# EAGLE design pits_hx1_v1.0 (EAGLE 6.4)
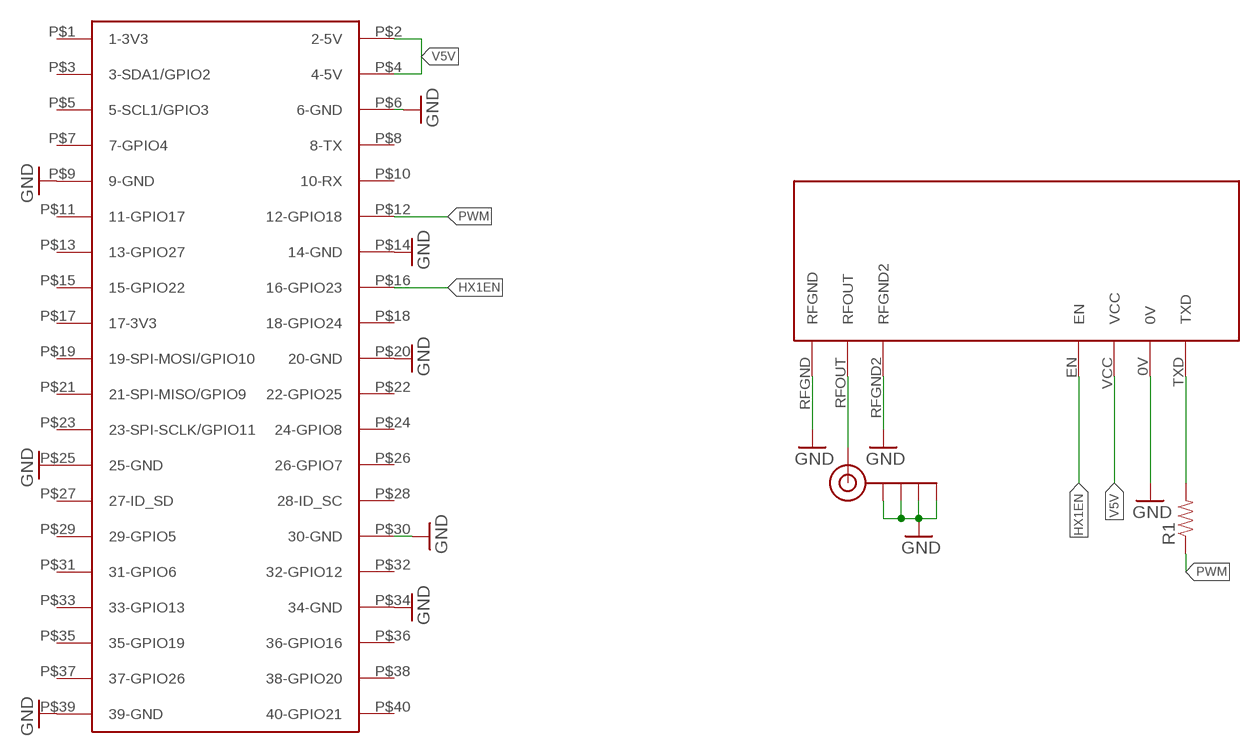
[diagram p0: schematic, sheet 1]

## Parts
J$1  SMA_EDGE  [SMA-EDGE]
R1  RESISTOR0603-RES  [0603-RES]
U$1  RASPBERRY-PI+  [RASPBERRY-PI-PLUS-CAM_NOTCH]
U$2  RADIOMETRIX-HX1  [RADIOMETRIX-HX1]

## Nets
GND: J$1.GND@0(GND) J$1.GND@1(GND) J$1.GND@2(GND) J$1.GND@3(GND) U$1.P$6(6-GND) U$1.P$9(9-GND) U$1.P$14(14-GND) U$1.P$20(20-GND) U$1.P$25(25-GND) U$1.P$30(30-GND) U$1.P$34(34-GND) U$1.P$39(39-GND) U$2.0V U$2.RFGND U$2.RFGND2
HX1EN: U$1.P$16(16-GPIO23) U$2.EN
N$4: R1.2 U$2.TXD
N$5: J$1.SIG(SIGNAL) U$2.RFOUT
PWM: R1.1 U$1.P$12(12-GPIO18)
V5V: U$1.P$2(2-5V) U$1.P$4(4-5V) U$2.VCC
Unconnected: U$1.P$1(1-3V3) U$1.P$3(3-SDA1/GPIO2) U$1.P$5(5-SCL1/GPIO3) U$1.P$7(7-GPIO4) U$1.P$8(8-TX) U$1.P$10(10-RX) U$1.P$11(11-GPIO17) U$1.P$13(13-GPIO27) U$1.P$15(15-GPIO22) U$1.P$17(17-3V3) U$1.P$18(18-GPIO24) U$1.P$19(19-SPI-MOSI/GPIO10) U$1.P$21(21-SPI-MISO/GPIO9) U$1.P$22(22-GPIO25) U$1.P$23(23-SPI-SCLK/GPIO11) U$1.P$24(24-GPIO8) U$1.P$26(26-GPIO7) U$1.P$27(27-ID_SD) U$1.P$28(28-ID_SC) U$1.P$29(29-GPIO5) U$1.P$31(31-GPIO6) U$1.P$32(32-GPIO12) U$1.P$33(33-GPIO13) U$1.P$35(35-GPIO19) U$1.P$36(36-GPIO16) U$1.P$37(37-GPIO26) U$1.P$38(38-GPIO20) U$1.P$40(40-GPIO21)

## Library data of the parts
J$1 = SparkFun:SMA_EDGE: SMA Antenna Connector End launch SMA connector. The paste layer has been removed so that the connector can be hand soldered onto the board after reflow.
R1 = SparkFun:RESISTOR: Resistor Basic schematic elements and footprints for 0603, 1206, and PTH resistors.
U$1 = Ava:RASPBERRY-PI+: Samtec SSW-120-01-T-D
U$2 = Ava:RADIOMETRIX-HX1

## Net classes
0 default: width 0.203 mm

## Board
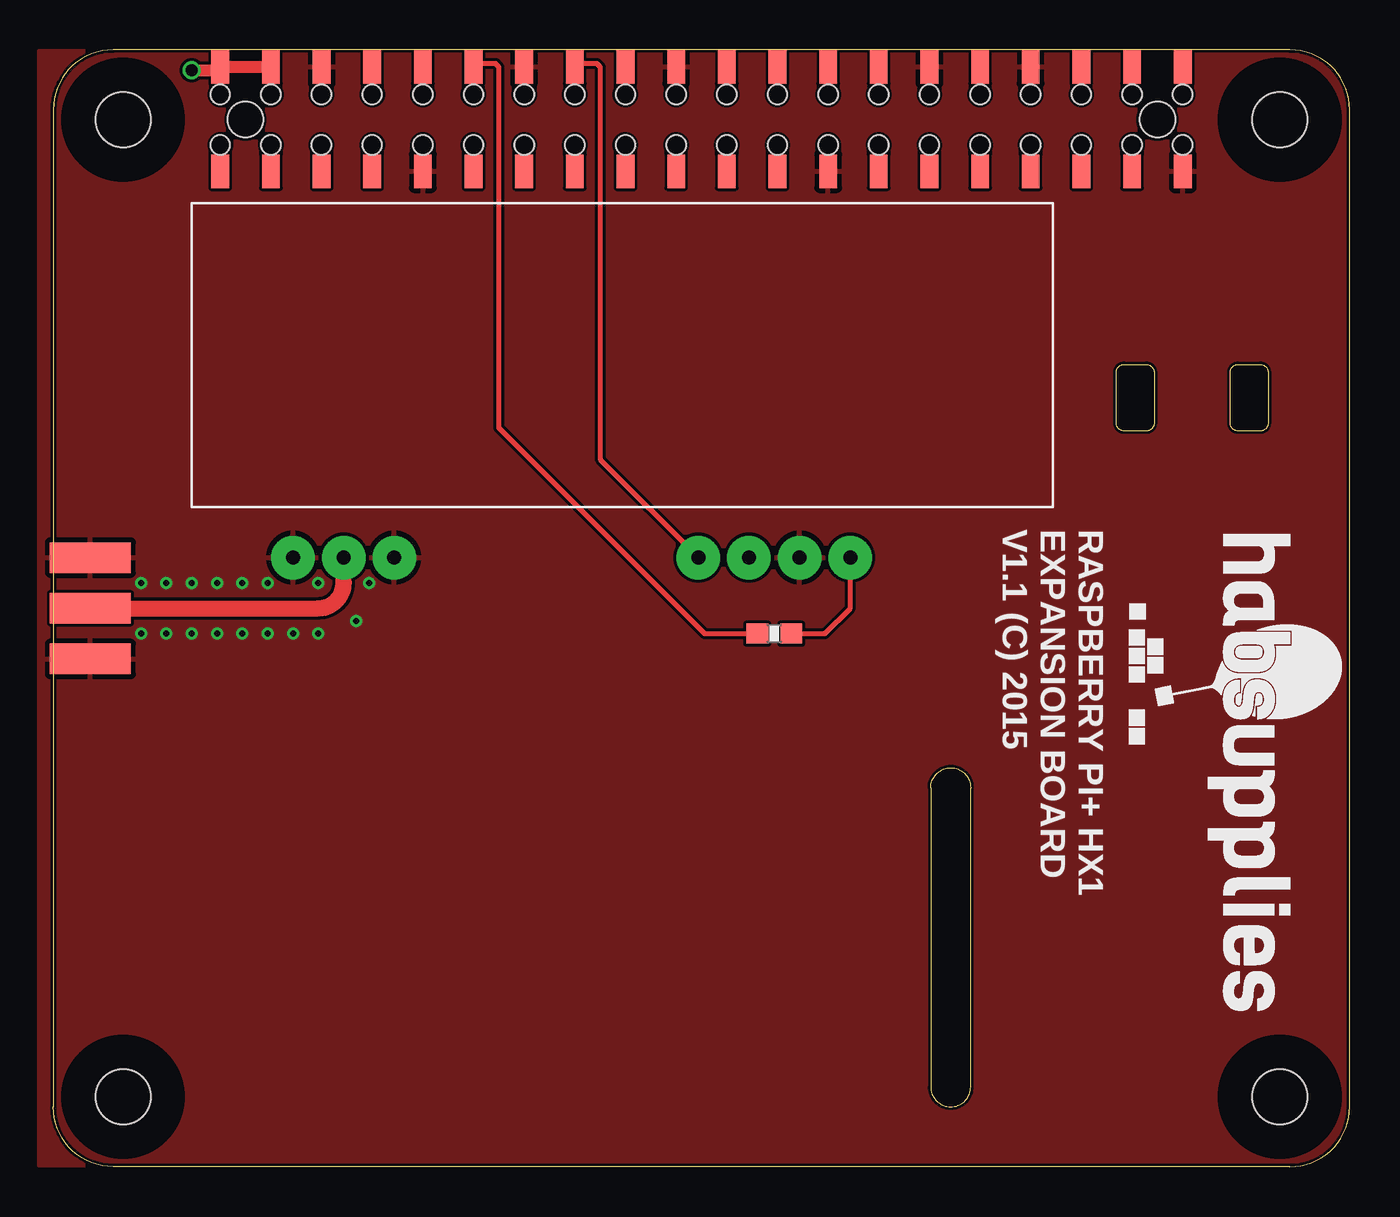
[diagram p1: board, top side]
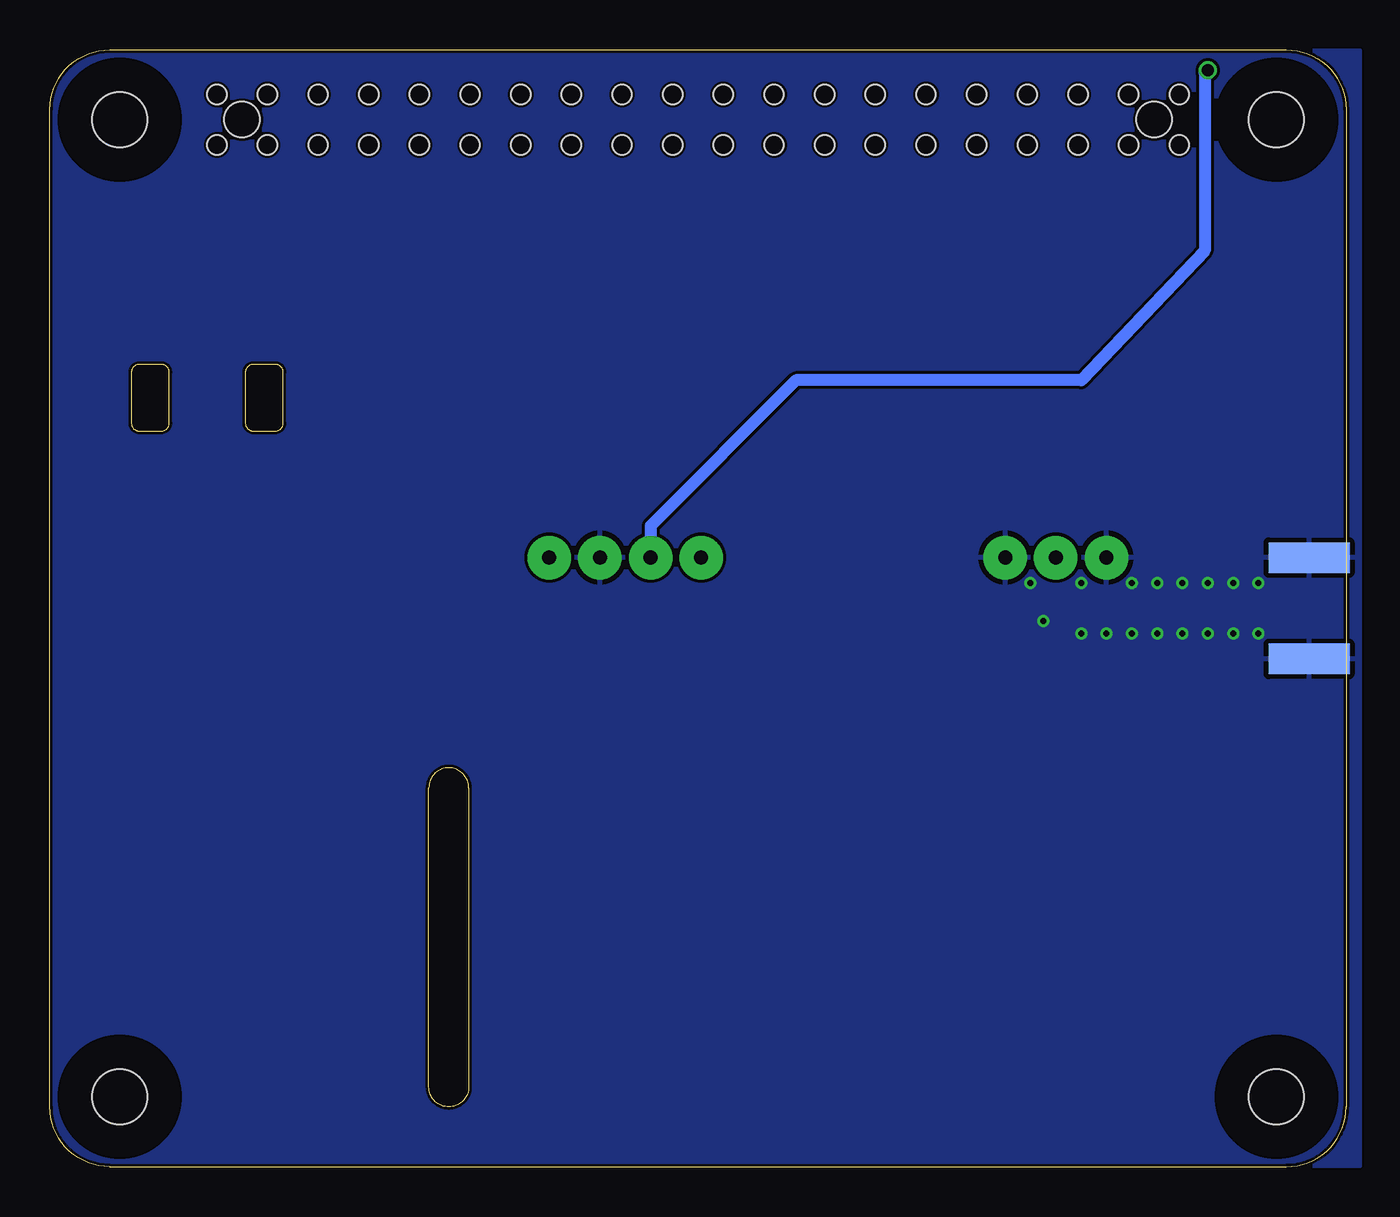
[diagram p2: board, bottom side, seen from below]

Size 65 x 56 mm. Coordinates in mm from the lower left corner, seen from the top.
Outline: 59.41,40.22 60.52,40.22 arc-90 60.91,39.82 60.91,37.29 arc-90 60.52,36.89 59.41,36.89 arc-90 59.01,37.29 59.01,39.82 arc-90 59.41,40.22
Outline: 53.7,40.22 54.8,40.22 arc-90 55.2,39.82 55.2,37.29 arc-90 54.8,36.89 53.7,36.89 arc-90 53.3,37.29 53.3,39.82 arc-90 53.7,40.22
Copper layers (1*16): Top 0.035mm / dielectric 1.5mm / Bottom 0.035mm
Design rules "Hackvana": minimum track width 0.15mm, minimum drill 0.3mm, track to track 6mil, track to pad 6mil, pad to pad 6mil, via to via 6mil, smd to smd 0mil, copper to edge 6mil, drill to drill 6mil, minimum pad ring 10mil, minimum via ring 6mil, stop-mask expansion 2mil, vias tented up to drill 100mil, thermal gap 10mil

### Footprints (pad centres in the part's own frame; a part is rotated, then mirrored left to right if it is on the bottom)
SMA-EDGE = smd 1.524 x 4.064: GND@0 -2.54,0; GND@1 2.54,0; SIG 0,0 | smd 1.524 x 4.064 bottom: GND@2 -2.54,0; GND@3 2.54,0
0603-RES = smd 1.1 x 1: 1 -0.85,0; 2 0.85,0
RASPBERRY-PI-PLUS-CAM_NOTCH = smd 0.889 x 1.68: P$1 -34.13,21.905; P$2 -34.13,27.145; P$3 -31.59,21.905; P$4 -31.59,27.145; P$5 -29.05,21.905; P$6 -29.05,27.145; P$7 -26.51,21.905; P$8 -26.51,27.145; P$9 -23.97,21.905; P$10 -23.97,27.145; P$11 -21.43,21.905; P$12 -21.43,27.145; P$13 -18.89,21.905; P$14 -18.89,27.145; P$15 -16.35,21.905; P$16 -16.35,27.145; P$17 -13.81,21.905; P$18 -13.81,27.145; P$19 -11.27,21.905; P$20 -11.27,27.145; P$21 -8.73,21.905; P$22 -8.73,27.145; P$23 -6.19,21.905; P$24 -6.19,27.145; P$25 -3.65,21.905; P$26 -3.65,27.145; P$27 -1.11,21.905; P$28 -1.11,27.145; P$29 1.43,21.905; P$30 1.43,27.145; P$31 3.97,21.905; P$32 3.97,27.145; P$33 6.51,21.905; P$34 6.51,27.145; P$35 9.05,21.905; P$36 9.05,27.145; P$37 11.59,21.905; P$38 11.59,27.145; P$39 14.13,21.905; P$40 14.13,27.145 | hole 2.75: -39,24.5; 19,24.5; -39,-24.5; 19,-24.5 | hole 1.78: -32.86,24.5; 12.86,24.5 | hole 0.97: -34.13,25.77; -31.59,25.77; -29.05,25.77; -26.51,25.77; -23.97,25.77; -21.43,25.77; -18.89,25.77; -16.35,25.77; -13.81,25.77; -11.27,25.77; -8.73,25.77; -6.19,25.77; -3.65,25.77; -1.11,25.77; 1.43,25.77; 3.97,25.77; 6.51,25.77; 9.05,25.77; 11.59,25.77; 14.13,25.77; -34.13,23.23; -31.59,23.23; -29.05,23.23; -26.51,23.23; -23.97,23.23; -21.43,23.23; -18.89,23.23; -16.35,23.23; -13.81,23.23; -11.27,23.23; -8.73,23.23; -6.19,23.23; -3.65,23.23; -1.11,23.23; 1.43,23.23; 3.97,23.23; 6.51,23.23; 9.05,23.23; 11.59,23.23; 14.13,23.23
RADIOMETRIX-HX1 = drill 0.7 pad 2.184: 0V 8.89,-10.16; EN 3.81,-10.16; RFGND -11.43,-10.16; RFGND2 -16.51,-10.16; RFOUT -13.97,-10.16; TXD 11.43,-10.16; VCC 6.35,-10.16

### Placement (x,y rotation side)
J$1  1.86,28 90 top
R1  36.15,26.73 0 top
U$1  42.5,28 0 top
U$2  28.53,40.7 0 top
U$3  [NEW-HS-LOGO-MED]  53.93,31.81 270 top

### Tracks (layer width: path | path; a pad name or v marks a point on that pad's centre or on a via)
GND  (via drill 0.3)
  other vias: 13.29,29.27 10.75,29.27 9.48,29.27 8.21,29.27 6.94,29.27 5.67,29.27 4.4,29.27 4.4,26.73 5.67,26.73 6.94,26.73 8.21,26.73 9.48,26.73 10.75,26.73 12.02,26.73 13.29,26.73 15.83,29.27 15.2,27.36
  pour Top: 0.59,55.94 65.36,55.94 65.36,0.06 -0.68,0.06 -0.68,55.94
  pour Bottom: 0.59,55.94 65.36,55.94 65.36,0.06 -0.68,0.06 -0.68,55.94
HX1EN
  Top 0.254: U$2.EN 27.42,35.46 27.42,55.15 27.26,55.3 26.31,55.3 U$1.P$16
N$4
  Top 0.254: R1.2 38.69,26.73 39.96,28 U$2.TXD
N$5
  Top 0.813: J$1.SIG 13.29,28 arc90 14.56,29.27 U$2.RFOUT
PWM
  Top 0.254: R1.1 32.66,26.73 22.34,37.05 22.34,55.15 22.18,55.3 21.23,55.3 U$1.P$12
V5V  (via drill 0.6)
  Top 0.61: v6.94,54.99 8.21,54.99 U$1.P$2 U$1.P$4
  Bottom 0.61: U$2.VCC 34.88,32.13 27.58,39.43 13.29,39.43 7.1,45.94 7.1,54.83 v6.94,54.99

### Text on the board
tPlace: RASPBERRY PI+ HX1 / EXPANSION BOARD / V1.1 (C) 2015